# Altium schematic sheet [4]LORA.SchDoc
size A
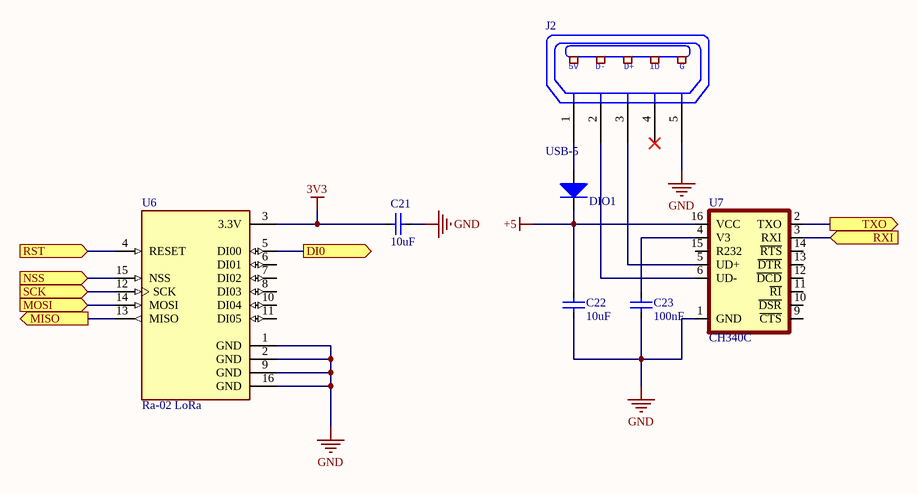
[diagram p0: [4]LORA.SchDoc]

## Parts
C21  10uF  [CAP_0805]
C22  10uF  [CAP_0805]
C23  100nF  [CAP_0805]
DIO1  Diode SMD  [DIO-SMD-106]  (value not drawn)
J2  USB-5  [USB-M1]
U6  Ra-02 LoRa  [Ra-02]
U7  CH340C  [SOP-16]

## Ports
DI0 (out), MISO (out), MOSI (in), NSS (in), RST (in), RXI (in), SCK (in), TXO (out)

## Nets
3V3: C21.1 U6.3(3.3V)
+5: C22.2 DIO1.2(K) U7.16(VCC)
GND: C21.2 C22.1 C23.1 J2.5(P5) U6.1(GND) U6.2(GND) U6.9(GND) U6.16(GND) U7.1(GND)
DI0: U6.5(DI00) ; port DI0
MISO: U6.13(MISO) ; port MISO
MOSI: U6.14(MOSI) ; port MOSI
NSS: U6.15(NSS) ; port NSS
RST: U6.4(RESET) ; port RST
RXI: U7.3(RXI) ; port RXI
SCK: U6.12(SCK) ; port SCK
TXO: U7.2(TXO) ; port TXO
NetC23_2: C23.2 U7.4(V3)
NetDIO1_1: DIO1.1(A) J2.1(P1)
NetJ2_2: J2.2(P2) U7.6(UD-)
NetJ2_3: J2.3(P3) U7.5(UD+)

Not connected (* = marked no-connect by the designer): J2 4(P4)*; U6 6(DI01) 7(DI02) 8(DI03) 10(DI04) 11(DI05); U7 9(~{CTS}) 10(~{DSR}) 11(~{RI}) 12(~{DCD}) 13(~{DTR}) 14(~{RTS}) 15(R232)

## Notes on the sheet
- (in symbol USB-5) 5V; D-; D+; ID; G

## Library data of the parts
C21-C23 = CapSMD: Capacitor; Value: 33p; Published: 8-Jun-2000; LatestRevisionDate: 17-Jul-2002; LatestRevisionNote: Re-released for DXP Platform.; PackageReference: RAD-0.3; Publisher: Altium Limited
DIO1 = Diode SMD: Default Diode; Code - JEDEC: DO-214-AB; Value: 1N5007; Published: 8-Jun-2000; Revision: July-2002: Re-released for DXP Platform.; Publisher: Altium Limited
J2 = USB-5: Manufacturer: FCI; Manufacturer Part Number: 10118193-0001LF; Connector Type: USB - micro B; Number of Contacts: 5; Gender: Receptacle; Specifications: USB 2.0; .Creator: MM; .Checked PCB: RF; Supplier 1: Digi-Key; RoHS: RoHS Compliant; Category: Connectors, Interconnects; Stock 1: 28642; Pricing 1: 1=0.46, 10=0.433, 25=0.3712, 50=0.3156, 100=0.3032, 250=0.27224, 500=0.25988 (USD); Packaging: Cut Tape (CT); Mounting Type: Surface Mount, Right Angle, Horizontal; Features: Shielded, Solder Retention; Ingress Protection: -; ComponentLink1URL: http://portal.fciconnect.com/Comergent//fci/drawing/10118193.pdf; ComponentLink1Description: http://portal.fciconnect.com/Comergent//fci/drawing/10118193.pdf; Supplier Part Number 1: 609-4616-1-ND; .Checked SCH: MM
U6 = Ra-02 LoRa: LoRa Module Ra-02
U7 = CH340C: USB to serial chip CH340; MF: WCH; Package: Package; Check_prices: https://www.snapeda.com/parts/CH340C/WCH/view-part/5428851/?ref=eda; Value: *; Price: None; MP: CH340C; Availability: Unavailable; SnapEDA_Link: https://www.snapeda.com/parts/CH340C/WCH/view-part/5428851/?ref=snap